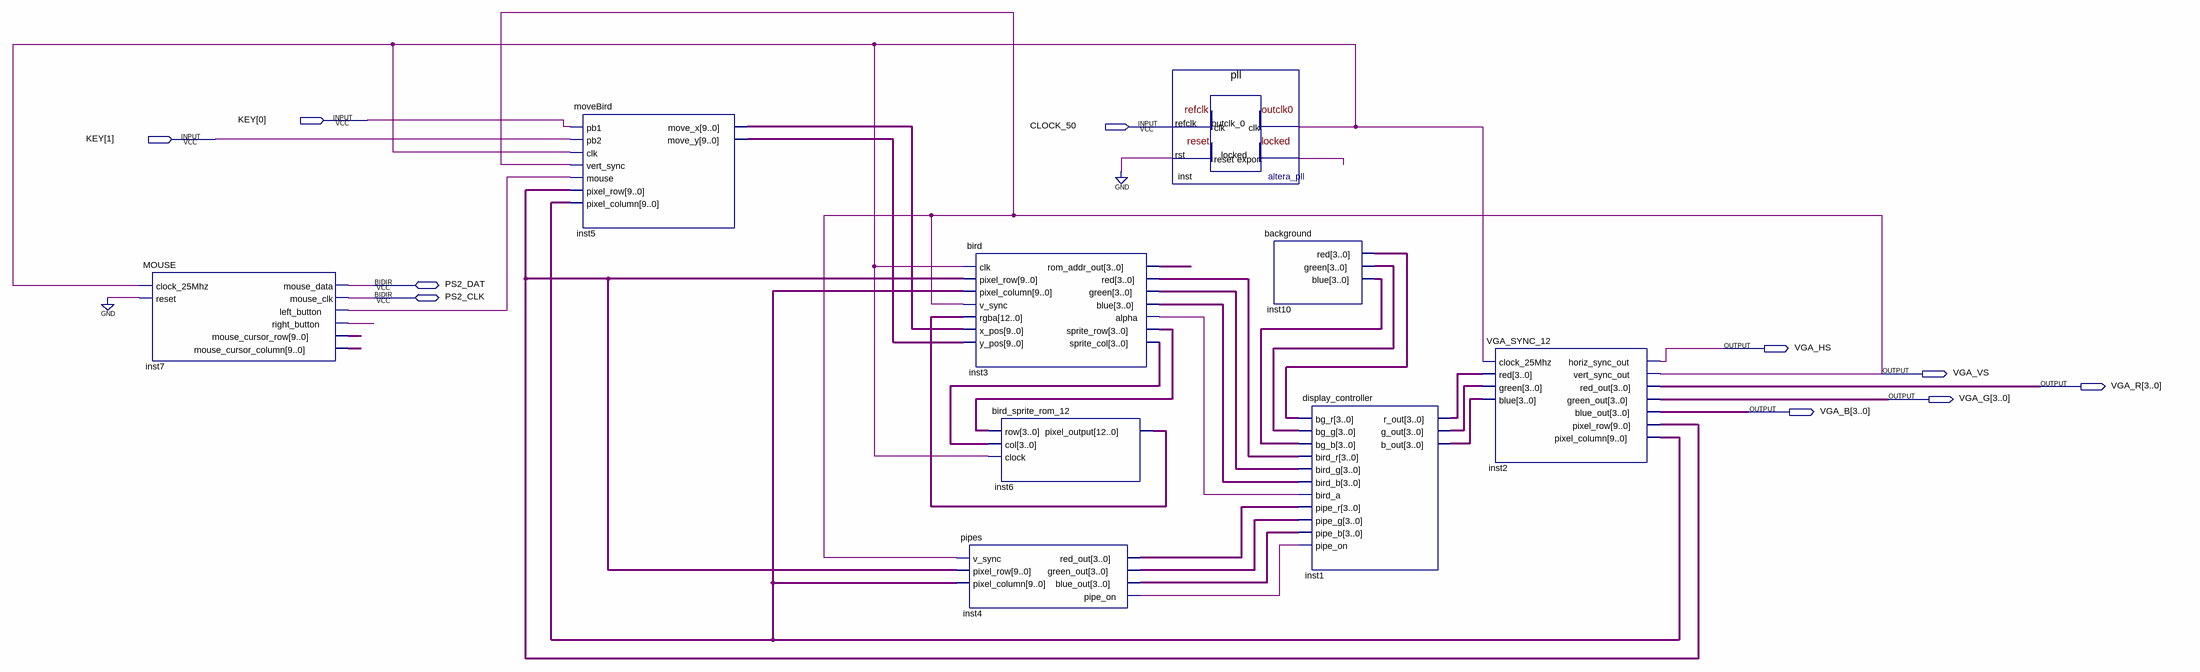
[diagram p0: schematic sheet]
// Quartus schematic display.bdf as structural Verilog: 9 symbols, 10 pins
module display (
  input  [1:0] KEY,
  input  CLOCK_50,
  inout  PS2_DAT,
  inout  PS2_CLK,
  output VGA_HS,
  output VGA_VS,
  output [3:0] VGA_R,
  output [3:0] VGA_G,
  output [3:0] VGA_B
);

  wire inst3_alpha, inst4_pipe_on, inst7_left_button, inst7_right_button, inst_locked, inst_outclk_0;
  wire [3:0] inst1_b_out, inst1_g_out, inst1_r_out, inst3_blue, inst3_green, inst3_red, inst3_rom_addr_out,
       inst3_sprite_col, inst3_sprite_row, inst4_blue_out, inst4_green_out, inst4_red_out, inst10_blue,
       inst10_green, inst10_red;
  wire [9:0] inst2_pixel_column, inst2_pixel_row, inst5_move_x, inst5_move_y, inst7_mouse_cursor_column,
       inst7_mouse_cursor_row;
  wire [12:0] inst6_pixel_output;

  MOUSE inst7 (
    .clock_25Mhz(inst_outclk_0), .reset(1'b0), .left_button(inst7_left_button),
    .right_button(inst7_right_button), .mouse_cursor_row(inst7_mouse_cursor_row),
    .mouse_cursor_column(inst7_mouse_cursor_column), .mouse_data(PS2_DAT), .mouse_clk(PS2_CLK));
  moveBird inst5 (
    .pb1(KEY[0]), .pb2(KEY[1]), .clk(inst_outclk_0), .vert_sync(VGA_VS), .mouse(inst7_left_button),
    .pixel_row(inst2_pixel_row), .pixel_column(inst2_pixel_column), .move_x(inst5_move_x),
    .move_y(inst5_move_y));
  bird inst3 (
    .clk(inst_outclk_0), .pixel_row(inst2_pixel_row), .pixel_column(inst2_pixel_column), .v_sync(VGA_VS),
    .rgba(inst6_pixel_output), .x_pos(inst5_move_x), .y_pos(inst5_move_y), .rom_addr_out(inst3_rom_addr_out),
    .red(inst3_red), .green(inst3_green), .blue(inst3_blue), .alpha(inst3_alpha),
    .sprite_row(inst3_sprite_row), .sprite_col(inst3_sprite_col));
  pipes inst4 (
    .v_sync(VGA_VS), .pixel_row(inst2_pixel_row), .pixel_column(inst2_pixel_column), .red_out(inst4_red_out),
    .green_out(inst4_green_out), .blue_out(inst4_blue_out), .pipe_on(inst4_pipe_on));
  bird_sprite_rom_12 inst6 (
    .row(inst3_sprite_row), .col(inst3_sprite_col), .clock(inst_outclk_0), .pixel_output(inst6_pixel_output));
  pll inst (.refclk(CLOCK_50), .rst(1'b0), .outclk_0(inst_outclk_0), .locked(inst_locked));
  background inst10 (.red(inst10_red), .green(inst10_green), .blue(inst10_blue));
  display_controller inst1 (
    .bg_r(inst10_red), .bg_g(inst10_green), .bg_b(inst10_blue), .bird_r(inst3_red), .bird_g(inst3_green),
    .bird_b(inst3_blue), .bird_a(inst3_alpha), .pipe_r(inst4_red_out), .pipe_g(inst4_green_out),
    .pipe_b(inst4_blue_out), .pipe_on(inst4_pipe_on), .r_out(inst1_r_out), .g_out(inst1_g_out),
    .b_out(inst1_b_out));
  VGA_SYNC_12 inst2 (
    .clock_25Mhz(inst_outclk_0), .red(inst1_r_out), .green(inst1_g_out), .blue(inst1_b_out),
    .horiz_sync_out(VGA_HS), .vert_sync_out(VGA_VS), .red_out(VGA_R), .green_out(VGA_G), .blue_out(VGA_B),
    .pixel_row(inst2_pixel_row), .pixel_column(inst2_pixel_column));
endmodule
